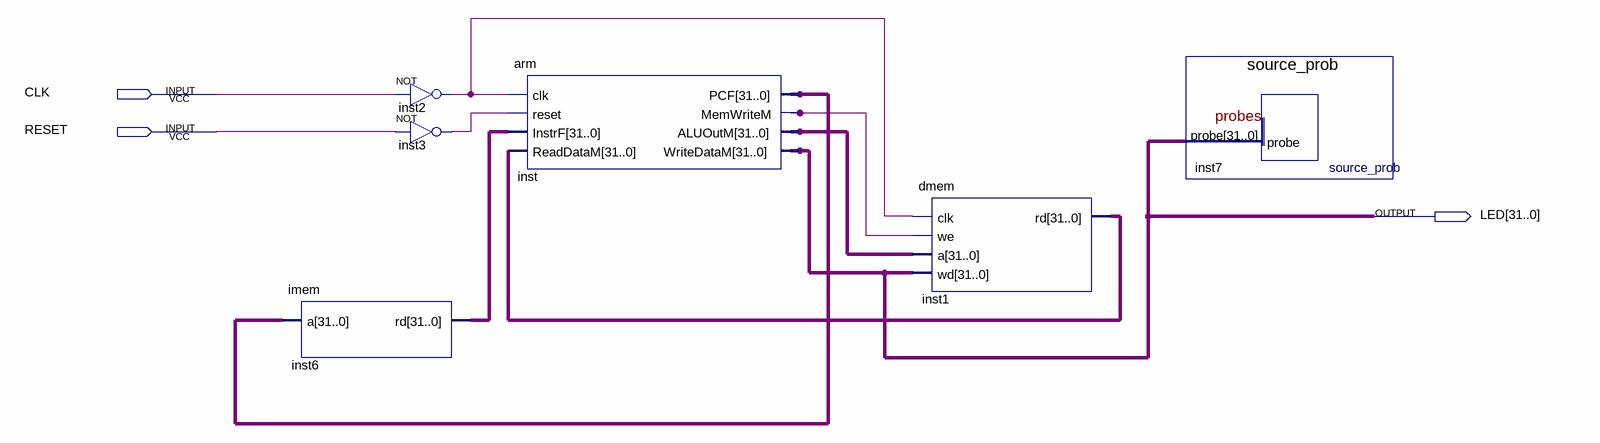
[diagram p0: schematic sheet]
// Quartus schematic ArmPipelined.bdf as structural Verilog: 6 symbols, 3 pins
module ArmPipelined (
  input  CLK,
  input  RESET,
  output [31:0] LED
);

  wire inst2_out, inst3_out, inst_memwritem;
  wire [31:0] inst1_rd, inst6_rd, inst_aluoutm, inst_pcf;

  imem inst6 (.a(inst_pcf), .rd(inst6_rd));
  not inst2 (inst2_out, CLK);
  not inst3 (inst3_out, RESET);
  arm inst (
    .clk(inst2_out), .reset(inst3_out), .InstrF(inst6_rd), .ReadDataM(inst1_rd), .PCF(inst_pcf),
    .MemWriteM(inst_memwritem), .ALUOutM(inst_aluoutm), .WriteDataM(LED));
  dmem inst1 (.clk(inst2_out), .we(inst_memwritem), .a(inst_aluoutm), .wd(LED), .rd(inst1_rd));
  source_prob inst7 (.probe(LED));
endmodule
